# Altium schematic sheet TIDA-01576_ADS8686S_AFE_Pg5-Voltage Measurement.SchDoc: Isolated Power Supply 1
size 431 x 279 mm; Date: Not shown in title block; ApprovedBy: Not shown in title block; CheckedBy: Not shown in title block; Author: Not shown in title block; CompanyName: Not shown in title block; DrawnBy: Sreenivasa; Engineer: Not shown in title block; Organization: Not shown in title block; Address1: Not shown in title block; Address2: Not shown in title block; Address3: Not shown in title block; Address4: Not shown in title block; DocumentNumber: 1; Revision: Use project parameter SCH_Rev; SheetNumber: 5; SheetTotal: 7; PageSetup: Record=PageOptions|CenterHorizontal=True|CenterVertical=True|PrintScale=1.00|XCorrection=1.00|YCorrection=1.00|PrintKind=0|BorderSize=5000000|LeftOffset=0|BottomOffset=0|Orientation=2|PaperLength=1000|PaperWidth=1000|Scale=100|PaperSource=15|PrintQuality=600|MediaType=1|DitherType=10|PaperKind=Letter|PrintScaleMode=1; CurrentTime: Not shown in title block; CurrentDate: Not shown in title block; Time: Not shown in title block; DocumentFullPathAndName: Not shown in title block; DocumentName: Not shown in title block; ModifiedDate: Not shown in title block; ImagePath: Not shown in title block
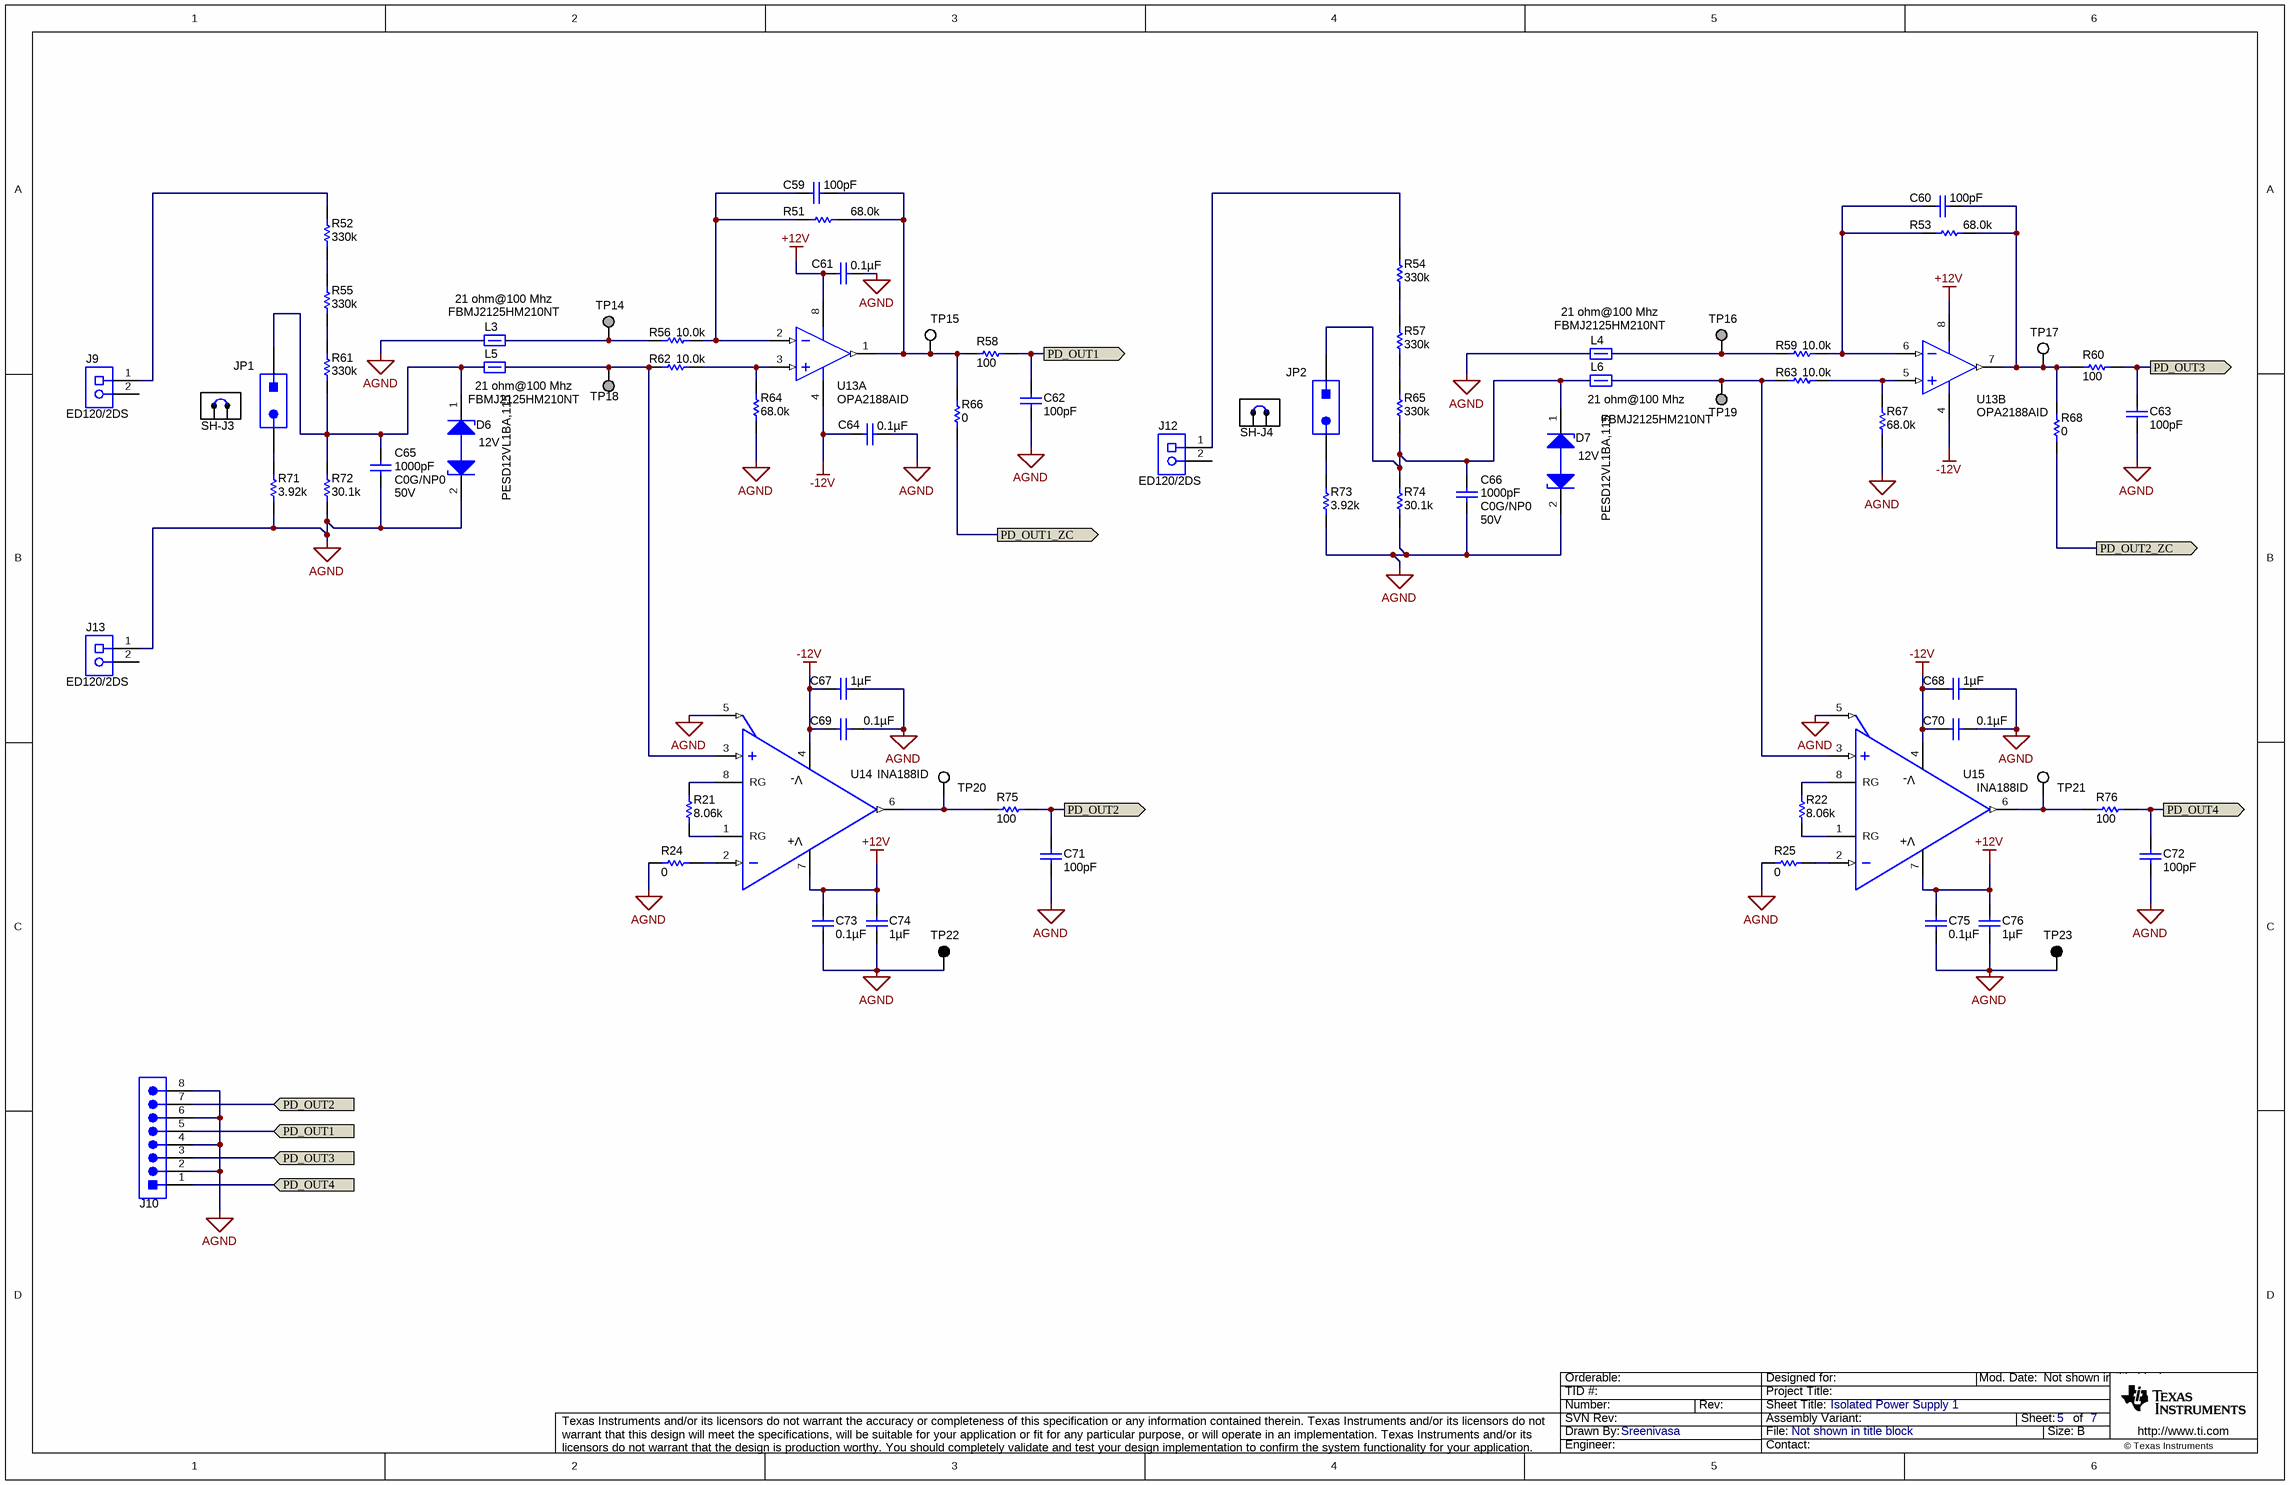
[diagram p0: TIDA-01576_ADS8686S_AFE_Pg5-Voltage Measurement.SchDoc]

## Parts
C59  ValueDisplayed: 100pF  [0603]  (hidden comment: 06033C101KAT2A)
C60  ValueDisplayed: 100pF  [0603]  (hidden comment: 06033C101KAT2A)
C61  ValueDisplayed: 0.1µF  [0603]  (hidden comment: 06033C104JAT2A)
C62  ValueDisplayed: 100pF  [0603]  (hidden comment: 06033C101KAT2A)
C63  ValueDisplayed: 100pF  [0603]  (hidden comment: 06033C101KAT2A)
C64  ValueDisplayed: 0.1µF  [0603]  (hidden comment: 06033C104JAT2A)
C65  ValueDisplayed: 1000pF  Value2: 50V  TempCo: C0G/NP0  [0603]  (hidden comment: C1608C0G1H102J080AA)
C66  ValueDisplayed: 1000pF  Value2: 50V  TempCo: C0G/NP0  [0603]  (hidden comment: C1608C0G1H102J080AA)
C67  ValueDisplayed: 1µF  [0603]  (hidden comment: GRM188R61C105KA93D)
C68  ValueDisplayed: 1µF  [0603]  (hidden comment: GRM188R61C105KA93D)
C69  ValueDisplayed: 0.1µF  [0603]  (hidden comment: CGA3E2X8R1E104K080AA)
C70  ValueDisplayed: 0.1µF  [0603]  (hidden comment: CGA3E2X8R1E104K080AA)
C71  ValueDisplayed: 100pF  [0603]  (hidden comment: 06033C101KAT2A)
C72  ValueDisplayed: 100pF  [0603]  (hidden comment: 06033C101KAT2A)
C73  ValueDisplayed: 0.1µF  [0603]  (hidden comment: CGA3E2X8R1E104K080AA)
C74  ValueDisplayed: 1µF  [0603]  (hidden comment: GRM188R61C105KA93D)
C75  ValueDisplayed: 0.1µF  [0603]  (hidden comment: CGA3E2X8R1E104K080AA)
C76  ValueDisplayed: 1µF  [0603]  (hidden comment: GRM188R61C105KA93D)
D6  value 12V  [SOD-323]  (hidden comment: PESD12VL1BA,115)
D7  value 12V  [SOD-323]  (hidden comment: PESD12VL1BA,115)
J9  ED120/2DS  [CONN_ED120-2DS]
J10  1803332  [Phoenix_1803332]  (value not drawn)
J12  ED120/2DS  [CONN_ED120-2DS]
J13  ED120/2DS  [CONN_ED120-2DS]
JP1  5-146280-2  [TSW-102-07-G-S]  (value not drawn)
JP2  5-146280-2  [TSW-102-07-G-S]  (value not drawn)
L3  value 21 ohm@100 Mhz  [0805_HV]  (hidden comment: FBMJ2125HM210NT)
L4  value 21 ohm@100 Mhz  [0805_HV]  (hidden comment: FBMJ2125HM210NT)
L5  value 21 ohm@100 Mhz  [0805_HV]  (hidden comment: FBMJ2125HM210NT)
L6  value 21 ohm@100 Mhz  [0805_HV]  (hidden comment: FBMJ2125HM210NT)
R21  ValueDisplayed: 8.06k  [0603]  (hidden comment: RG1608P-8061-B-T5)
R22  ValueDisplayed: 8.06k  [0603]  (hidden comment: RG1608P-8061-B-T5)
R24  ValueDisplayed: 0  [0603]  (hidden comment: RC0603JR-070RL)
R25  ValueDisplayed: 0  [0603]  (hidden comment: RC0603JR-070RL)
R51  ValueDisplayed: 68.0k  [0603]  (hidden comment: RG1608P-683-B-T5)
R52  ValueDisplayed: 330k  [TNPV1206]  (hidden comment: TNPV1206330KBEEN)
R53  ValueDisplayed: 68.0k  [0603]  (hidden comment: RG1608P-683-B-T5)
R54  ValueDisplayed: 330k  [TNPV1206]  (hidden comment: TNPV1206330KBEEN)
R55  ValueDisplayed: 330k  [TNPV1206]  (hidden comment: TNPV1206330KBEEN)
R56  ValueDisplayed: 10.0k  [0603]  (hidden comment: RG1608P-103-B-T5)
R57  ValueDisplayed: 330k  [TNPV1206]  (hidden comment: TNPV1206330KBEEN)
R58  ValueDisplayed: 100  [0603]  (hidden comment: RG1608P-101-B-T5)
R59  ValueDisplayed: 10.0k  [0603]  (hidden comment: RG1608P-103-B-T5)
R60  ValueDisplayed: 100  [0603]  (hidden comment: RG1608P-101-B-T5)
R61  ValueDisplayed: 330k  [TNPV1206]  (hidden comment: TNPV1206330KBEEN)
R62  ValueDisplayed: 10.0k  [0603]  (hidden comment: RG1608P-103-B-T5)
R63  ValueDisplayed: 10.0k  [0603]  (hidden comment: RG1608P-103-B-T5)
R64  ValueDisplayed: 68.0k  [0603]  (hidden comment: RG1608P-683-B-T5)
R65  ValueDisplayed: 330k  [TNPV1206]  (hidden comment: TNPV1206330KBEEN)
R66  ValueDisplayed: 0  [0603]  (hidden comment: RC0603JR-070RL)
R67  ValueDisplayed: 68.0k  [0603]  (hidden comment: RG1608P-683-B-T5)
R68  ValueDisplayed: 0  [0603]  (hidden comment: RC0603JR-070RL)
R71  ValueDisplayed: 3.92k  [0603]  (hidden comment: RG1608P-3921-B-T5)
R72  ValueDisplayed: 30.1k  [0603]  (hidden comment: RG1608P-3012-B-T5)
R73  ValueDisplayed: 3.92k  [0603]  (hidden comment: RG1608P-3921-B-T5)
R74  ValueDisplayed: 30.1k  [0603]  (hidden comment: RG1608P-3012-B-T5)
R75  ValueDisplayed: 100  [0603]  (hidden comment: RG1608P-101-B-T5)
R76  ValueDisplayed: 100  [0603]  (hidden comment: RG1608P-101-B-T5)
SH-J3  881545-2  [TE_881545-2]  (value not drawn)  (mechanical)
SH-J4  881545-2  [TE_881545-2]  (value not drawn)  (mechanical)
TP14  Suggest using a net name here  [Keystone1573-2]  (value not drawn)
TP15  5002  [Keystone5002]  (value not drawn)
TP16  Suggest using a net name here  [Keystone1573-2]  (value not drawn)
TP17  5002  [Keystone5002]  (value not drawn)
TP18  Suggest using a net name here  [Keystone1573-2]  (value not drawn)
TP19  Suggest using a net name here  [Keystone1573-2]  (value not drawn)
TP20  5002  [Keystone5002]  (value not drawn)
TP21  5002  [Keystone5002]  (value not drawn)
TP22  5001  [Keystone5001]  (value not drawn)
TP23  5001  [Keystone5001]  (value not drawn)
U13  OPA2188AID  [D0008A_N]  (parts A,B of 2)
U14  INA188ID  [D0008A_N]
U15  INA188ID  [D0008A_N]

## Ports
PD_OUT1 (in), PD_OUT1 (out), PD_OUT1_ZC (out), PD_OUT2 (in), PD_OUT2 (out), PD_OUT2_ZC (out), PD_OUT3 (in), PD_OUT3 (out), PD_OUT4 (in), PD_OUT4 (out)

## Nets
+12V: C61.2 C73.1 C74.1 C75.1 C76.1 U13.8(V+) U14.7(V+) U15.7(V+)
-12V: C64.2 C67.1 C68.1 C69.1 C70.1 U13.4(V-) U14.4(V-) U15.4(V-)
AGND: C61.1 C62.2 C63.2 C64.1 C65.1 C66.1 C67.2 C68.2 C69.2 C70.2 C71.2 C72.2 C73.2 C74.2 C75.2 C76.2 D6.2(K) D7.2(K) J10.2 J10.4 J10.6 J10.8 J13.1 L3.1 L4.1 R24.2 R25.2 R64.1 R67.1 R71.1 R72.1 R73.1 R74.1 TP22.1 TP23.1 U14.5(REF) U15.5(REF)
PD_OUT1: C62.1 J10.5 R58.2 ; port PD_OUT1
PD_OUT1_ZC: R66.1 ; port PD_OUT1_ZC
PD_OUT2: C71.1 J10.7 R75.2 ; port PD_OUT2
PD_OUT2_ZC: R68.1 ; port PD_OUT2_ZC
PD_OUT3: C63.1 J10.3 R60.2 ; port PD_OUT3
PD_OUT4: C72.1 J10.1 R76.2 ; port PD_OUT4
NetC59_1: C59.1 R51.2 R56.1 U13.2(IN_A-)
NetC59_2: C59.2 R51.1 R58.1 R66.2 TP15.1 U13.1(OUT_A)
NetC60_1: C60.1 R53.2 R59.1 U13.6(IN_B-)
NetC60_2: C60.2 R53.1 R60.1 R68.2 TP17.1 U13.7(OUT_B)
NetC65_2: C65.2 D6.1(K) JP1.1 L5.1 R61.1 R72.2
NetC66_2: C66.2 D7.1(K) JP2.1 L6.1 R65.1 R74.2
NetJ9_1: J9.1 R52.2
NetJ12_1: J12.1 R54.2
NetJP1_2: JP1.2 R71.2
NetJP2_2: JP2.2 R73.2
NetL3_2: L3.2 R56.2 TP14.1
NetL4_2: L4.2 R59.2 TP16.1
NetL5_2: L5.2 R62.2 TP18.1 U14.3(IN+)
NetL6_2: L6.2 R63.2 TP19.1 U15.3(IN+)
NetR21_1: R21.1 U14.1(RG)
NetR21_2: R21.2 U14.8(RG)
NetR22_1: R22.1 U15.1(RG)
NetR22_2: R22.2 U15.8(RG)
NetR24_1: R24.1 U14.2(IN-)
NetR25_1: R25.1 U15.2(IN-)
NetR52_1: R52.1 R55.2
NetR54_1: R54.1 R57.2
NetR55_1: R55.1 R61.2
NetR57_1: R57.1 R65.2
NetR62_1: R62.1 R64.2 U13.3(IN_A+)
NetR63_1: R63.1 R67.2 U13.5(IN_B+)
NetR75_1: R75.1 TP20.1 U14.6(OUT)
NetR76_1: R76.1 TP21.1 U15.6(OUT)

Not connected (* = marked no-connect by the designer): J9 2; J12 2; J13 2

## Notes on the sheet
- Drawn By:
- SVN Rev:
- Number:
- TID #:
- Orderable:
- Rev:
- Sheet Title:
- File:
- Project Title:
- Designed for:
- Assembly Variant:
- Mod. Date:
- Sheet:
- Size:
- of
- B
- http://www.ti.com
- Texas Instruments and/or its licensors do not warrant the accuracy or completeness of this specification or any information contained therein. Texas Instruments and/or its licensors do not warrant that this design will meet the specifications, will be suitable for your application or fit for any particular purpose, or will operate in an implementation. Texas Instruments and/or its licensors do not warrant that the design is production worthy. You should completely validate and test your design implementation to confirm the system functionality for your application.
- Engineer:
- Contact:
- © Texas Instruments

## Library data of the parts
C59 C60 C62 C63 C71 C72 = 06033C101KAT2A: CAP, CERM, 100pF, 25V, +/-10%, X7R, 0603; Manufacturer: AVX; Polarized: N; CompType: Capacitor; U/M: EA; Cap_F: 0.0000000001; Tolerance_%: 10; Value1: Unknown; VDC_V: 25; TaMin_C: -55; TaMax_C: 125; SymbolVersion: 2008-07-09; Value: 100pF; PartNumber: 06033C101KAT2A; PackageReference: 0603; RoHS: Y; Value2: 25V; MountType: SMT; Technology: Ceramic; TempCo: X7R; Cap_Case: 0603; Published: 2008-06-19; Publisher: Texas Instruments; LatestRevisionDate: 2013-12-06; ComponentLink1Description: Datasheet link; ComponentLink1URL: http://www.avx.com/docs/Catalogs/cx7r.pdf; Supplier 1: Digikey; Supplier Part Number 1: 478-7899-1-ND; Supplier 2: Newark; Supplier Part Number 2: 55J3899
C61 C64 = 06033C104JAT2A: CAP, CERM, 0.1uF, 25V, +/-5%, X7R, 0603; Manufacturer: AVX; Polarized: N; CompType: Capacitor; U/M: EA; Cap_F: 0.0000001; Tolerance_%: 5; ESR_Ohm: 0.05; Value1: 0.05 ohm; VDC_V: 25; TaMin_C: -55; TaMax_C: 125; SymbolVersion: 2008-07-09; Value: 0.1uF; PartNumber: 06033C104JAT2A; PackageReference: 0603; RoHS: Y; Value2: 25V; MountType: SMT; Technology: Ceramic; TempCo: X7R; Cap_Case: 0603; Published: 2008-06-19; Publisher: Texas Instruments; LatestRevisionDate: 2013-12-06; ComponentLink1Description: Datasheet link; ComponentLink1URL: http://www.avx.com/docs/masterpubs/smccp.pdf; Supplier 1: Digi-Key; Supplier Part Number 1: 478-3713-1-ND; Supplier 2: Mouser; Supplier Part Number 2: 581-06033C104JAT2A; Supplier 3: Farnell; Supplier Part Number 3: 1740614
C65 C66 = C1608C0G1H102J: CAP, CERM, 1000pF, 50V, +/-5%, C0G/NP0, 0603; Manufacturer: TDK; Polarized: N; CompType: Capacitor; U/M: EA; Cap_F: 0.000000001; Tolerance_%: 5; ESR_Ohm: 0.0563; Value1: 0.0563 ohm; VDC_V: 50; TaMin_C: -55; TaMax_C: 125; SymbolVersion: 2008-07-09; Value: 1000pF; PartNumber: C1608C0G1H102J080AA; PackageReference: 0603; RoHS: Y; MountType: SMT; Technology: Ceramic; Cap_Case: 0603; Published: 2008-06-19; Publisher: Texas Instruments; LatestRevisionDate: 2014-04-30; ComponentLink1Description: Datasheet link; ComponentLink1URL: http://www.tdk.co.jp/tefe02/e412_c.pdf; Supplier 1: Digi-Key; Supplier Part Number 1: 445-1293-1-ND; Supplier 2: Farnell; Supplier Part Number 2: 1907307
C67 C68 C74 C76 = C1608X5R1C105K: CAP, CERM, 1 µF, 16 V, +/- 10%, X5R, 0603; Manufacturer: Murata; Polarized: N; CompType: Capacitor; Value: 1uF; U/M: EA; Cap_F: 0.000001; Tolerance_%: 10; ESR_ohm: 0.0057; Value1: 0.0057 ohm; VDC_V: 16; Value2: 16V; TaMin_C: -55; TaMax_C: 85; AEC Category: Q200; SymbolVersion: 2008-07-09; PartNumber: GRM188R61C105KA93D; PackageReference: 0603; RoHS: Y; MountType: SMT; Technology: Ceramic; TempCo: X5R; Cap_Case: 0603; Published: 2008-06-19; Publisher: Texas Instruments; LatestRevisionDate: 2015-10-13; ComponentLink1Description: Datasheet link; ComponentLink1URL: http://www.tdk.co.jp/tefe02/e412_c.pdf; Supplier 1: Digi-Key; Supplier Part Number 1: 490-1536-1-ND; Supplier 2: Farnell; Supplier Part Number 2: 1844208; AEC Qualified: ?
C69 C70 C73 C75 = CGA3E2X8R1E104K080AA: CAP, CERM, 0.1 µF, 25 V, +/- 10%, X8R, AEC-Q200 Grade 0, 0603; Manufacturer: TDK; Polarized: N; CompType: Capacitor; Value: 0.1uF; U/M: EA; Cap_F: 0.0000001; Tolerance_%: 10; Value1: Unknown; VDC_V: 25; Value2: 25V; TaMin_C: -55; TaMax_C: 150; AEC Category: Q200; AEC Qualified: Y; AEC Grade: 0; SymbolVersion: 2008-07-09; PartNumber: CGA3E2X8R1E104K080AA; PackageReference: 0603; RoHS: Y; MountType: SMT; Technology: Ceramic; TempCo: X8R; Cap_Case: 0603; Published: 2008-06-19; Publisher: Texas Instruments; LatestRevisionDate: 2015-10-13; ComponentLink1Description: Datasheet link; ComponentLink1URL: http://www.tdk.com/pdf/mlcc_prod_guide/MLCC%20Product%20Guide%20A14.pdf; Supplier 1: Digi-Key; Supplier Part Number 1: 445-5885-1-ND; Supplier 2: Mouser; Supplier Part Number 2: 810-CGA3E2X8R1E104K; Supplier 3: Farnell; Supplier Part Number 3: 2210887
D6 D7 = PESD3V3L1BA: TVS DIODE 12VWM 37VC SOD323; Manufacturer: NXP Semiconductor; SymbolCreator: x0199378; PartNumber: PESD12VL1BA,115; PackageReference: SOD323; MountType: SMT; RoHS: Y; ComponentLink1Description: Datasheet link; ComponentLink1URL: http://www.nxp.com/documents/data_sheet/PESDXL1BA_SER.pdf; SymbolVersion: 2015-04-16; CompType: DIODE; Supplier 1: Digi-Key; Supplier Part Number 1: 568-4022-1-ND
J9 J12 J13 = ED120/2DS: TERMINAL BLOCK 5.08MM VERT 2POS, TH; Manufacturer: On-Shore Technology; SymbolCreator: a0412235; U/M: EA; SymbolVersion: 2013-09-04; PartNumber: ED120/2DS; PackageReference: TERM_BLK, 2pos, 5.08mm; CompType: Terminal Block; RoHS: Y; MountType: TH; ComponentLink1Description: Datasheet Link; ComponentLink1URL: http://www.on-shore.com/sites/default/files/manuals/ed120ds.pdf; Publisher: Texas Instruments; LatestRevisionDate: 2013-12-06; Supplier 1: Digi-Key; Supplier Part Number 1: ED1609-ND
J10 = CMP-0078749-1: Header(shrouded), 3.81mm, 8x1, Tin, R/A, TH; Manufacturer: Phoenix Contact; Pitch_mm: 3.81; Cert_VDE: Y; Gender: Male; Voltage_V: 160V; Current_A: 8A; Row_Count: 1; ComponentLink1Description: Datasheet URL; RoHS: Y; Supplier Part Number 3: 651-1803332; Supplier 1: Digi-Key; Cert_CSA: Y; Cert_UL: Y; Orientation: R/A; PackageReference: Header(shrouded), 3.81mm, 8x1, R/A, TH; Color: Green; PartNumber: 1803332; PinCount: 8; Supplier Part Number 2: 14X8982; ContactFinish: Tin; Supplier 2: Newark; Shrouded: Y; ComponentLink1URL: https://www.phoenixcontact.com/online/portal/us/pxc/product_detail_page/!ut/p/z1/5VfJcuIwEP0V5sAtQi1bXnI0DgNhCxOWYF9csi0oZbzFdsjy9SMDqSFUDWQqxckula2l35Net1olYxcvsZuwjVizUqQJi2TbcXVv1p51OhNFJ3e_tDbc3mh2Z0jvSW-s4AV2sVvwiAclD21W8nWav2HHGg6rgZL52CFVLQuC39iZIE; CompType: Header; MountType: TH; Supplier Part Number 1: 277-1212-ND; Supplier 3: Mouser
JP1 JP2 = TSW-102-07-G-S: Header, 100mil, 2x1, Gold, TH; Manufacturer: TE Connectivity; SymbolCreator: a0412235; U/M: EA; SymbolVersion: 2013-10-31; PartNumber: 5-146280-2; ClassName: Header; PackageReference: 2x1 Header; CompType: Header; RoHS: Y; MountType: TH; ComponentLink1Description: Datasheet Link; ComponentLink1URL: http://samtec.com/ftppub/pdf/TSW_TH.PDF; Publisher: Texas Instruments; LatestRevisionDate: 2015-10-21; Supplier 1: Digi-Key; Supplier Part Number 1: A121480-ND
L3-L6 = FBMJ2125HM210NT: Ferrite Bead, 21 ohm @ 100 MHz, 6 A, 0805; Manufacturer: Taiyo Yuden; Imax_A: 6; DCR_ohm: 0.004; Value1: 0.004 ohm; Value2: 6A; ZTyp@100MHz_Ohm: 21; CompType: Ferrite Bead; SymbolVersion: 2009-06-02; PartNumber: FBMJ2125HM210NT; MountType: SMT; PackageReference: 0805; Published: 2014-04-30; Publisher: Texas Instruments; LatestRevisionDate: 2015-08-20; ComponentLink1Description: Datasheet link; ComponentLink1URL: http://www.yuden.co.jp/us/product/pdf/efbm_e.pdf; RoHS: Y; Supplier 1: Digi-Key; Supplier Part Number 1: 587-1765-1-ND
R21 R22 = RG1608P-8061-B-T5: RES, 8.06 k, 0.1%, 0.1 W, 0603; Manufacturer: Susumu Co Ltd; CompType: Resistor; Value: 8.06k; Res_ohm: 8060; Value_Code: 8k06; Tolerance_%: 0.1; Value2: 0.1W; VDC_V: 75; TempCo: 25 ppm/C; SizeArea_mm2: 1.28; SizeX_mm: 1.6; SizeY_mm: 0.8; SizeZ_mm: 1; EIA_Code: E192; U/M: EA; AEC Category: Q200; SymbolVersion: 2009-05-29; PartNumber: RG1608P-8061-B-T5; PackageReference: 0603; RoHS: Y; Value1: 0.1%; Power_W: 0.1; MountType: SMT; Technology: Metal Film; Published: 2008-06-26; Publisher: Texas Instruments; LatestRevisionDate: 2017-06-13; ComponentLink1Description: Datasheet link; ComponentLink1URL: http://www.susumu.co.jp/english/pdf/products-j01-01.pdf; Supplier 1: Digi-Key; Supplier Part Number 1: RG16P8.06KBCT-ND; Supplier 2: Mouser; Supplier Part Number 2: 754-RG1608P-8061-BT5; AEC Qualified: ?
R24 R25 R66 R68 = RC0603JR-070RL: RES, 0, 5%, 0.1 W, 0603; Manufacturer: Yageo America; CompType: Resistor; Value: 0; Value_Code: 0000; Tolerance_%: 5; Power_W: 0.1; Value2: 0.1W; VDC_V: 50; TempCo: 200 ppm/C; EIA_Code: E24; U/M: EA; AEC Category: Q200; SymbolVersion: 2009-05-29; PartNumber: RC0603JR-070RL; PackageReference: 0603; RoHS: Y; Res_ohm: 0; Value1: 5%; MountType: SMT; Technology: Thick Film; Published: 2008-06-26; Publisher: Texas Instruments; LatestRevisionDate: 2016-03-05; ComponentLink1Description: Datasheet link; ComponentLink1URL: http://www.yageo.com/pdf/Pu-RC0603_51_PbFree_L_2.pdf; Supplier 1: Digi-Key; Supplier Part Number 1: 311-0.0GRCT-ND; Supplier 2: Mouser; Supplier Part Number 2: 603-RC0603JR-070RL; Supplier 3: Farnell; Supplier Part Number 3: 9233130; AEC Qualified: ?
R51 R53 R64 R67 = RG1608P-683-B-T5: RES, 68.0 k, 0.1%, 0.1 W, 0603; Manufacturer: Susumu Co Ltd; CompType: Resistor; Value: 68.0k; Res_ohm: 68000; Value_Code: 68k0; Tolerance_%: 0.1; Value2: 0.1W; VDC_V: 75; TempCo: 25 ppm/C; SizeArea_mm2: 1.28; SizeX_mm: 1.6; SizeY_mm: 0.8; SizeZ_mm: 1; U/M: EA; AEC Category: Q200; SymbolVersion: 2009-05-29; PartNumber: RG1608P-683-B-T5; PackageReference: 0603; RoHS: Y; Value1: 0.1%; Power_W: 0.1; MountType: SMT; Technology: Metal Film; Published: 2008-06-26; Publisher: Texas Instruments; LatestRevisionDate: 2017-06-13; ComponentLink1Description: Datasheet link; ComponentLink1URL: http://www.susumu.co.jp/english/pdf/products-j01-01.pdf; Supplier 1: Digi-Key; Supplier Part Number 1: RG16P68.0KBCT-ND; Supplier 2: Mouser; Supplier Part Number 2: 754-RG1608P-683-BT5; Supplier 3: Farnell; Supplier Part Number 3: 9368558; AEC Qualified: ?
R52 R54 R55 R57 R61 R65 = TNPV1206330KBEEN: RES, 330 k, 0.1%, 1 W, 1206; Manufacturer: Vishay Draloric; CompType: Resistor; Value: 330k; Res_ohm: 330000; Tolerance_%: 0.1; Power_W: 1; Value2: 1W; VDC_V: 700; TempCo: 25 ppm/C; SizeArea_mm2: 5.12; SizeX_mm: 3.2; SizeY_mm: 1.6; SizeZ_mm: 0.65; U/M: EA; AEC Category: Q200; AEC Qualified: N; SymbolVersion: 2009-05-29; PartNumber: TNPV1206330KBEEN; PackageReference: 1206; RoHS: Y; Value_Code: 330k; Value1: 0.1%; MountType: SMT; Technology: Thin Film; Published: 2008-06-26; Publisher: Texas Instruments; LatestRevisionDate: 2017-06-12; ComponentLink1Description: Datasheet link; ComponentLink1URL: http://www.vishay.com/docs/28881/tnpve3.pdf; Supplier 1: Digi-Key; Supplier Part Number 1: 541-2312-1-ND; Supplier 2: Newark; Supplier Part Number 2: 46Y8550; Supplier 3: Mouser; Supplier Part Number 3: 71-TNPV1206330KBEEN; AEC Grade: N/A
R56 R59 R62 R63 = RG1608P-103-B-T5: RES, 10.0 k, 0.1%, 0.1 W, 0603; Manufacturer: Susumu Co Ltd; CompType: Resistor; Value: 10.0k; Res_ohm: 10000; Value_Code: 10k0; Tolerance_%: 0.1; Value2: 0.1W; VDC_V: 75; TempCo: 25 ppm/C; SizeArea_mm2: 1.28; SizeX_mm: 1.6; SizeY_mm: 0.8; SizeZ_mm: 1; EIA_Code: E192; U/M: EA; AEC Category: Q200; Green_Lifecycle: Active; Green_REACh: Passed; SymbolVersion: 2009-05-29; PartNumber: RG1608P-103-B-T5; PackageReference: 0603; RoHS: Y; Value1: 0.1%; Power_W: 0.1; MountType: SMT; Technology: Metal Film; Published: 2008-06-26; Publisher: Texas Instruments; LatestRevisionDate: 2017-06-13; ComponentLink1Description: Datasheet link; ComponentLink1URL: http://www.susumu.co.jp/english/pdf/products-j01-01.pdf; Supplier 1: Digi-Key; Supplier Part Number 1: RG16P10.0KBCT-ND; Supplier 2: Mouser; Supplier Part Number 2: 754-RG1608P-103-B-T5; Supplier 3: Farnell; Supplier Part Number 3: 1797079; AEC Qualified: ?; Green_EU RoHS: Passed; Green_EU RoHS-2: Passed
R58 R60 R75 R76 = RG1608P-101-B-T5: RES, 100, 0.1%, 0.1 W, 0603; Manufacturer: Susumu Co Ltd; CompType: Resistor; Value: 100; Value_Code: 100R; Tolerance_%: 0.1; Value2: 0.1W; VDC_V: 75; TempCo: 25 ppm/C; SizeArea_mm2: 1.28; SizeX_mm: 1.6; SizeY_mm: 0.8; SizeZ_mm: 1; EIA_Code: E192; U/M: EA; AEC Category: Q200; Green_Lifecycle: Active; Green_REACh: Passed; SymbolVersion: 2009-05-29; PartNumber: RG1608P-101-B-T5; PackageReference: 0603; RoHS: Y; Res_ohm: 100; Value1: 0.1%; Power_W: 0.1; MountType: SMT; Technology: Metal Film; Published: 2008-06-26; Publisher: Texas Instruments; LatestRevisionDate: 2017-06-13; ComponentLink1Description: Datasheet link; ComponentLink1URL: http://www.susumu.co.jp/english/pdf/products-j01-01.pdf; Supplier 1: Digi-Key; Supplier Part Number 1: RG16P100BCT-ND; Supplier 2: Mouser; Supplier Part Number 2: 754-RG1608P-101-B-T5; Supplier 3: Farnell; Supplier Part Number 3: 1797075; AEC Qualified: ?; Green_EU RoHS: Passed; Green_EU RoHS-2: Passed
R71 R73 = RG1608P-3921-B-T5: RES, 3.92 k, 0.1%, 0.1 W, 0603; Manufacturer: Susumu Co Ltd; CompType: Resistor; Value: 3.92k; Res_ohm: 3920; Value_Code: 3k92; Tolerance_%: 0.1; Value2: 0.1W; VDC_V: 75; TempCo: 25 ppm/C; SizeArea_mm2: 1.28; SizeX_mm: 1.6; SizeY_mm: 0.8; SizeZ_mm: 1; EIA_Code: E192; U/M: EA; AEC Category: Q200; SymbolVersion: 2009-05-29; PartNumber: RG1608P-3921-B-T5; PackageReference: 0603; RoHS: Y; Value1: 0.1%; Power_W: 0.1; MountType: SMT; Technology: Metal Film; Published: 2008-06-26; Publisher: Texas Instruments; LatestRevisionDate: 2017-06-13; ComponentLink1Description: Datasheet link; ComponentLink1URL: http://www.susumu.co.jp/english/pdf/products-j01-01.pdf; Supplier 1: Digi-Key; Supplier Part Number 1: RG16P3.92KBCT-ND; Supplier 2: Mouser; Supplier Part Number 2: 754-RG1608P-3921-BT5; Supplier 3: Farnell; Supplier Part Number 3: 1797178; AEC Qualified: ?
R72 R74 = RG1608P-3012-B-T5: RES, 30.1 k, 0.1%, 0.1 W, 0603; Manufacturer: Susumu Co Ltd; CompType: Resistor; Value: 30.1k; Res_ohm: 30100; Value_Code: 30k1; Tolerance_%: 0.1; Value2: 0.1W; VDC_V: 75; TempCo: 25 ppm/C; SizeArea_mm2: 1.28; SizeX_mm: 1.6; SizeY_mm: 0.8; SizeZ_mm: 1; EIA_Code: E192; U/M: EA; AEC Category: Q200; Green_Lifecycle: Active; Green_REACh: Passed; SymbolVersion: 2009-05-29; PartNumber: RG1608P-3012-B-T5; PackageReference: 0603; RoHS: Y; Value1: 0.1%; Power_W: 0.1; MountType: SMT; Technology: Metal Film; Published: 2008-06-26; Publisher: Texas Instruments; LatestRevisionDate: 2017-06-13; ComponentLink1Description: Datasheet link; ComponentLink1URL: http://www.susumu.co.jp/english/pdf/products-j01-01.pdf; Supplier 1: Digi-Key; Supplier Part Number 1: RG16P30.1KBCT-ND; Supplier 2: Mouser; Supplier Part Number 2: 754-RG1608P-3012-BT5; Supplier 3: Farnell; Supplier Part Number 3: 1797150; AEC Qualified: ?; Green_EU RoHS: Passed; Green_EU RoHS-2: Passed
SH-J3 SH-J4 = 881545-2: Shunt, 100mil, Gold plated, Black; Manufacturer: TE Connectivity; CompType: Shunt; PartNumber: 881545-2; RoHS: Y; PackageReference: Shunt 2 pos. 100 mil; MountType: N/A; ComponentLink1Description: Datasheet Link; ComponentLink1URL: http://www.te.com/commerce/DocumentDelivery/DDEController?Action=srchrtrv&DocNm=881545&DocType=Customer+Drawing&DocLang=English; Publisher: Texas Instruments; LatestRevisionDate: 2014-09-20; Supplier 1: Digi-Key; Supplier Part Number 1: A26242-ND; Supplier 2: Mouser; Supplier Part Number 2: 571-8815452; Supplier 3: Farnell; Supplier Part Number 3: 1654806
TP14 TP16 TP18 TP19 = 1573-2: Terminal, Turret, TH, Double; Manufacturer: Keystone; CompType: Turret Terminal; U/M: EA; SymbolVersion: 2010-10-20; PartNumber: 1573-2; Value: Double; PackageReference: Keystone1573-2; RoHS: Y; MountType: TH; ComponentLink1Description: Datasheet Link; ComponentLink1URL: http://www.keyelco.com/pdfs/M55p126.pdf; Publisher: Texas Instruments; LatestRevisionDate: 2015-08-25; Supplier 1: Digi-Key; Supplier Part Number 1: 36-1573-2-ND
TP15 TP17 TP20 TP21 = 5002: Test Point, Miniature, White, TH; Manufacturer: Keystone; CompType: Test Point Loop; U/M: EA; SymbolVersion: 2008-04-04; PartNumber: 5002; PackageReference: White Miniature Testpoint; RoHS: Y; MountType: TH; ComponentLink1Description: Datasheet Link; ComponentLink1URL: http://www.keyelco.com/userAssets/file/M60-2p60.pdf; Value: White; Publisher: Texas Instruments; LatestRevisionDate: 2015-08-25; Supplier 1: Digi-Key; Supplier Part Number 1: 36-5002-ND; Supplier 2: Newark; Supplier Part Number 2: 82H9632
TP22 TP23 = 5001: Test Point, Miniature, Black, TH; Manufacturer: Keystone; CompType: Test Point Loop; U/M: EA; SymbolVersion: 2008-04-04; PartNumber: 5001; PackageReference: Black Miniature Testpoint; RoHS: Y; MountType: TH; ComponentLink1Description: Datasheet Link; ComponentLink1URL: http://www.keyelco.com/userAssets/file/M60-2p60.pdf; Value: Black; Publisher: Texas Instruments; LatestRevisionDate: 2015-08-25; Supplier 1: Digi-Key; Supplier Part Number 1: 36-5001-ND
U13 = OPA2188AID: 0.03 uV/degC, 6 uV Vos, Low Noise, Rail-to-Rail Output, Zero-Drift Operational Amplifier, 4 to 36 V, -40 to 105 degC, 8-pin SOIC (D0008A), Green (RoHS & no Sb/Br); Manufacturer: Texas Instruments; Alternate PartNumber: Equivalent; CMRR(Min)(dB): 120; GBW(Typ)(MHz): 2; IIB(Max)(pA): 850; Iq per channel(Max)(mA): 0.475; Offset Drift(Typ)(uV/C): 0.03; Packing: TUBE; Rating: Catalog; Slew Rate(Typ)(V/us): 0.8; Sub Family: High Supply Voltage Amplifier (>=30V), Low Noise Amp (<=10nV/rtHz), Low Offset Voltage Amplifier (<=500uV), Low Power Amp (<=500uA), Precision Amplifier, Zero Drift Precision Amplifier; Total Supply Voltage(Max)(+5V is 5, +/-5V is 10): 36; Total Supply Voltage(Min)(+5V is 5, +/-5V is 10): 4; Vio (25C)(Max)(mV): 0.025; DatasheetVersion: SBOS525B; PackageVersion: 4040047-3/M, 06/2011; PackageReference: D0008A; PackageDescription: 8-Pin Plastic Small Outline, Body 4.9 x 3.9 mm, Pitch 1.27 mm; Supplier 1: Digi-Key; Supplier Part Number 1: 296-36123-5-ND; Supplier 2: Newark; Supplier Part Number 2: 61T5954; Supplier 3: Mouser; Supplier Part Number 3: 595-OPA2188AID; Eco-Plan: Green (RoHS & no Sb/Br); Number of Channels: 2; MountType: SMT; Code_JEDEC: MS-012; PartNumber: OPA2188AID; ComponentLink1Description: Manufacturer URL; ComponentLink1URL: http://www.ti.com/; ComponentLink2Description: Datasheet; ComponentLink2URL: http://www.ti.com/lit/ds/symlink/opa2188.pdf; ComponentLink3Description: Package Specification; ComponentLink3URL: http://www.ti.com/litv/pdf/msoi002j; Alternate Manufacturer: Texas Instruments
U14 U15 = INA188D: INA188 Precision, Zero-Drift, Rail-to-Rail Out, High Voltage Instrumentation Amplifier, D0008A; Manufacturer: Texas Instruments; SymbolCreator: Altium; CompType: IC; U/M: EA; SymbolVersion: 2014-07-02; PartNumber: INA188ID; PackageReference: D0008A; MountType: SMT; ComponentLink1Description: Datasheet Link; ComponentLink1URL: https://sps06.itg.ti.com/sites/KMS/crossdivteams/altium/docs/ComponentDatasheets/INA188_Datasheet_061914.pdf; RoHS: Y; Publisher: Texas Instruments; LatestRevisionDate: 2015-10-14; Alternate Manufacturer: Texas Instruments; Supplier Part Number 1: 296-44312-ND; Supplier 1: Digi-Key